# EAGLE design SixPotatoeV4 (EAGLE 9.6.0)
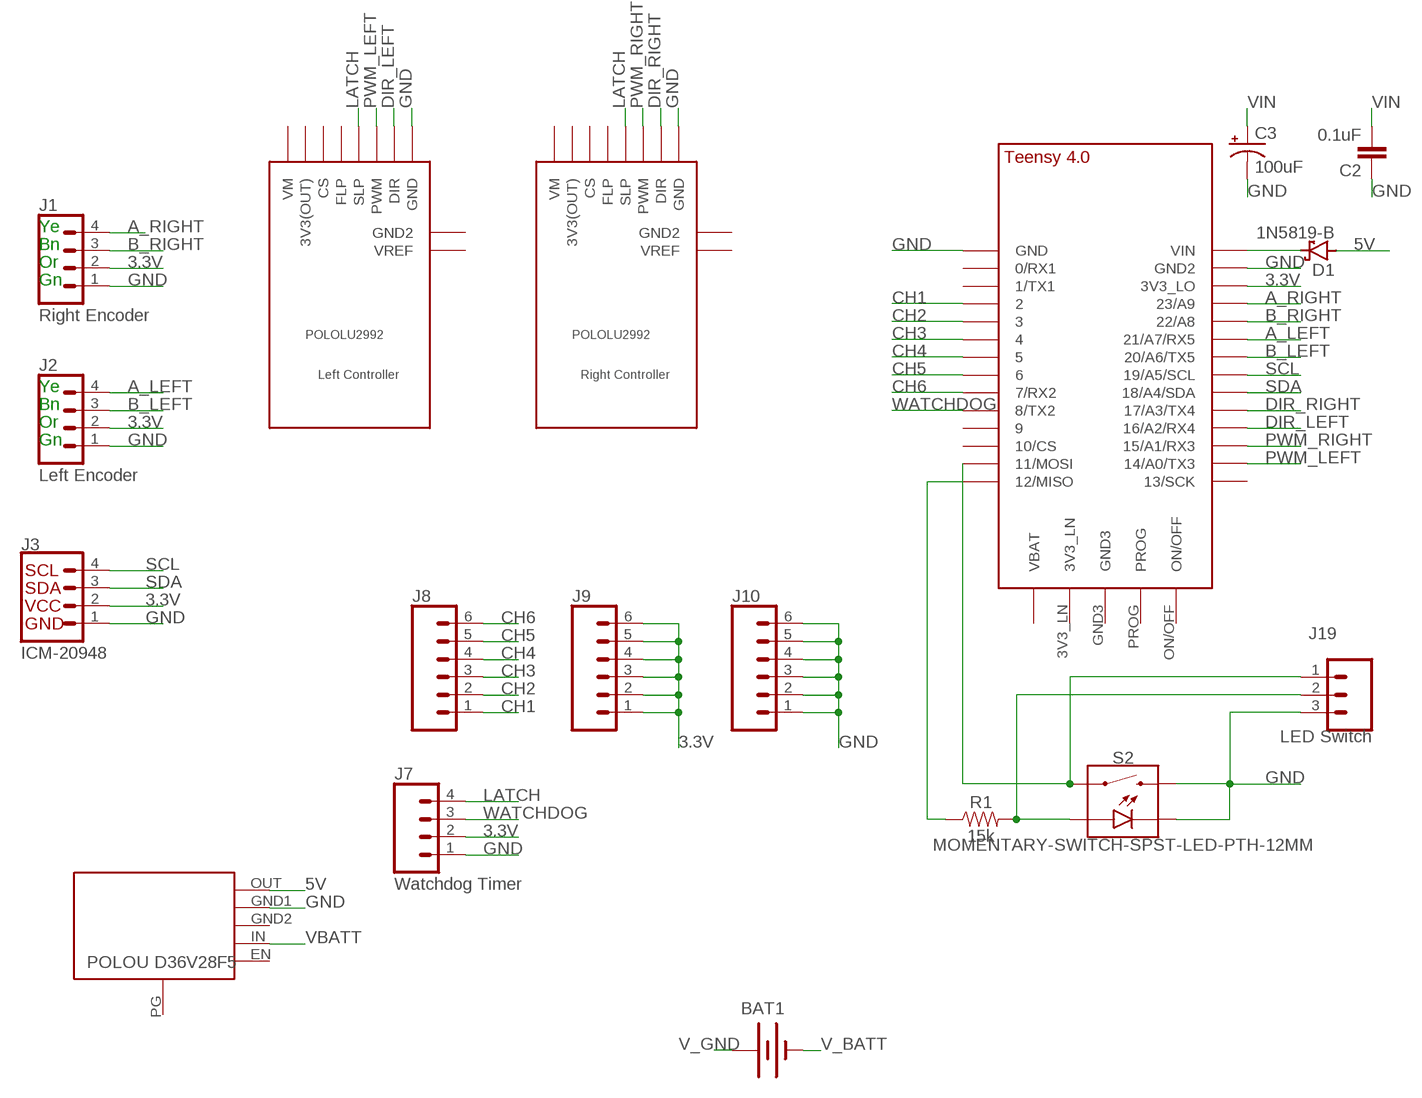
[diagram p0: schematic, sheet 1]

## Parts
BAT1  XT60_MALE  [XT60]
C2  0.1uF  0.1UF-KIT-EZ-50V-20%  [CAP-PTH-SMALL-KIT]
C3  100uF  100UF-POLAR-RADIAL-2.5MM-25V-20%  [CPOL-RADIAL-2.5MM-6.5MM]
D1  1N5819-B  [DO41-7.6]
J1  CONN_04  [1X04]
J2  CONN_04  [1X04]
J3  I2C_STANDARD  [1X04]
J7  CONN_04  [1X04]
J8  CONN_06NO_SILK_FEMALE_PTH  [1X06_NO_SILK]
J9  CONN_06NO_SILK_FEMALE_PTH  [1X06_NO_SILK]
J10  CONN_06NO_SILK_FEMALE_PTH  [1X06_NO_SILK]
J19  CONN_03  [1X03]
R1  15k  15KOHM-HORIZ-1/4W-5%  [AXIAL-0.3]
S2  MOMENTARY-SWITCH-SPST-LED-PTH-12MM  [TACTILE_SWITCH_LED_PTH_12MM]
U$1  TEENSY_4.0  [TEENSY_4.0]
U$2  Left Controller  POLOLU2992_2  [POLOLU2992_2]
U$3  Right Controller  POLOLU2992_2  [POLOLU2992_2]
U$4  POLOU3782  [POLOU3782]

## Nets
3.3V: J1.2 J2.2 J3.2 J7.2 J9.1 J9.2 J9.3 J9.4 J9.5 J9.6 U$1.3V3_LO
5V: D1.A U$4.OUT
A_LEFT: J2.4 U$1.21/A7(21/A7/RX5)
A_RIGHT: J1.4 U$1.23/A9
B_LEFT: J2.3 U$1.20/A6(20/A6/TX5)
B_RIGHT: J1.3 U$1.22/A8
CH1: J8.1 U$1.2
CH2: J8.2 U$1.3/CANTX
CH3: J8.3 U$1.4/CANRX
CH4: J8.4 U$1.5
CH5: J8.5 U$1.6
CH6: J8.6 U$1.7(7/RX2)
DIR_LEFT: U$1.16/A2(16/A2/RX4) U$2.DIR
DIR_RIGHT: U$1.17/A3(17/A3/TX4) U$3.DIR
GND: C2.1 C3.2(-) J1.1 J2.1 J3.1 J7.1 J10.1 J10.2 J10.3 J10.4 J10.5 J10.6 J19.3 S2.2 S2.C U$1.GND U$1.GND2 U$2.GND U$3.GND U$4.GND1
LATCH: J7.4 U$2.SLP U$3.SLP
N$1: D1.C U$1.VIN
N$2: J19.2 R1.P$2 S2.A
N$3: R1.P$1 U$1.12/MISO
N$4: J19.1 S2.4 U$1.11/MOSI
PWM_LEFT: U$1.14/A0(14/A0/TX3) U$2.PWM
PWM_RIGHT: U$1.15/A1(15/A1/RX3) U$3.PWM
SCL: J3.4 U$1.19/A5/SCL
SDA: J3.3 U$1.18/A4/SDA
V_BATT: BAT1.-
V_GND: BAT1.+
VBATT: U$4.IN
VIN: C2.2 C3.1(+)
WATCHDOG: J7.3 U$1.8(8/TX2)
Unconnected: U$1.0/RX(0/RX1) U$1.1/TX(1/TX1) U$1.3V3_LN U$1.9/CS U$1.10/CS U$1.13/SCK U$1.GND3 U$1.ON/OFF U$1.PROG U$1.VBAT\(VBAT) U$2.3V3(OUT) U$2.CS U$2.FLP U$2.GND2 U$2.VM U$2.VREF U$3.3V3(OUT) U$3.CS U$3.FLP U$3.GND2 U$3.VM U$3.VREF U$4.EN U$4.GND2 U$4.PG

## Notes on the sheet
- Ye
- Bn
- Or
- Gn
- Ye
- Bn
- Or
- Gn

## Library data of the parts
BAT1 = Tristan+Robitaille's+Library:XT60_MALE: Vertical Mount Through-Hole Male (for female battery) XT60 Connector
C2 = SparkFun-Capacitors:0.1UF: 0.1µF ceramic capacitors A capacitor is a passive two-terminal electrical component used to store electrical energy temporarily in an electric field.; PROD_ID: CAP-08370
C3 = SparkFun-Capacitors:100UF-POLAR: 100µF polarized capacitors A capacitor is a passive two-terminal electrical component used to store electrical energy temporarily in an electric field.; PROD_ID: CAP-08439
D1 = diode:1N581*: 1.0A SCHOTTKY BARRIER RECTIFIER Source: http://www.diodes.com/datasheets/ds23001.pdf
J1 = SparkFun-Connectors:CONN_04: Multi connection point. Often used as Generic Header-pin footprint for 0.1 inch spaced/style header connections On any of the 0.1 inch spaced packages, you can populate with these: Break Away Headers - Straight <https://www.sparkfun.com/products/116> (PRT-00116) Break Away Male Headers - Right Angle <https://www.sparkfun.com/products/553> (PRT-00553) Female Headers <https://www.sparkfun.com/products/115> (PRT-00115) Break Away Headers - Machine Pin <https://www.sparkfun.com/products/117> (PRT-00117) Break Away Female Headers - Swiss Machine Pin <https://www.sparkfun.com/products/743> (PRT-00743) For SCREWTERMINALS and SPRING TERMINALS visit here: Screw Terimnals on SparkFun.com <https://www.sparkfun.com/search/results?term=Screw+Terminals> (5mm/3.5mm/2.54mm spacing) This device is also useful as a general connection point to wire up your design to another part of your project. Our various solder wires solder well into these plated through hole pads. Hook-Up Wire - Assortment (Stranded, 22 AWG) <https://www.sparkfun.com/products/11375> (PRT-11375) Hook-Up Wire - Assortment (Solid Core, 22 AWG) <https://www.sparkfun.com/products/11367> (PRT-11367) View the entire wire category on our website here <https://www.sparkfun.com/categories/141> Special notes: Molex polarized connector foot print use with SKU : PRT-08231 with associated crimp pins and housings. 1MM SMD Version SKU: PRT-10208; ID: Right Encoder; PROD_ID: CONN-09696
J2 = SparkFun-Connectors:CONN_04: Multi connection point. Often used as Generic Header-pin footprint for 0.1 inch spaced/style header connections On any of the 0.1 inch spaced packages, you can populate with these: Break Away Headers - Straight <https://www.sparkfun.com/products/116> (PRT-00116) Break Away Male Headers - Right Angle <https://www.sparkfun.com/products/553> (PRT-00553) Female Headers <https://www.sparkfun.com/products/115> (PRT-00115) Break Away Headers - Machine Pin <https://www.sparkfun.com/products/117> (PRT-00117) Break Away Female Headers - Swiss Machine Pin <https://www.sparkfun.com/products/743> (PRT-00743) For SCREWTERMINALS and SPRING TERMINALS visit here: Screw Terimnals on SparkFun.com <https://www.sparkfun.com/search/results?term=Screw+Terminals> (5mm/3.5mm/2.54mm spacing) This device is also useful as a general connection point to wire up your design to another part of your project. Our various solder wires solder well into these plated through hole pads. Hook-Up Wire - Assortment (Stranded, 22 AWG) <https://www.sparkfun.com/products/11375> (PRT-11375) Hook-Up Wire - Assortment (Solid Core, 22 AWG) <https://www.sparkfun.com/products/11367> (PRT-11367) View the entire wire category on our website here <https://www.sparkfun.com/categories/141> Special notes: Molex polarized connector foot print use with SKU : PRT-08231 with associated crimp pins and housings. 1MM SMD Version SKU: PRT-10208; ID: Left Encoder; PROD_ID: CONN-09696
J3 = SparkFun-Connectors:I2C_STANDARD: SparkFun I2C Standard Pinout Header SparkFun has standardized on a pinout for all I2C based sensor breakouts. This pinout allows I2C boards to be plugged directly into the headers on Arduino Uno compatible boards, and to be daisy chained easily. Example SparkFun Products: SparkFun Atmospheric Sensor Breakout - BME280 <https://www.sparkfun.com/products/13676> SparkFun Altitude/Pressure Sensor Breakout - MPL3115A2 <https://www.sparkfun.com/products/11084> SparkFun TOF Range Finder Sensor - VL6180 <https://www.sparkfun.com/products/12785>; ID: ICM-20948
J7 = SparkFun-Connectors:CONN_04: Multi connection point. Often used as Generic Header-pin footprint for 0.1 inch spaced/style header connections On any of the 0.1 inch spaced packages, you can populate with these: Break Away Headers - Straight <https://www.sparkfun.com/products/116> (PRT-00116) Break Away Male Headers - Right Angle <https://www.sparkfun.com/products/553> (PRT-00553) Female Headers <https://www.sparkfun.com/products/115> (PRT-00115) Break Away Headers - Machine Pin <https://www.sparkfun.com/products/117> (PRT-00117) Break Away Female Headers - Swiss Machine Pin <https://www.sparkfun.com/products/743> (PRT-00743) For SCREWTERMINALS and SPRING TERMINALS visit here: Screw Terimnals on SparkFun.com <https://www.sparkfun.com/search/results?term=Screw+Terminals> (5mm/3.5mm/2.54mm spacing) This device is also useful as a general connection point to wire up your design to another part of your project. Our various solder wires solder well into these plated through hole pads. Hook-Up Wire - Assortment (Stranded, 22 AWG) <https://www.sparkfun.com/products/11375> (PRT-11375) Hook-Up Wire - Assortment (Solid Core, 22 AWG) <https://www.sparkfun.com/products/11367> (PRT-11367) View the entire wire category on our website here <https://www.sparkfun.com/categories/141> Special notes: Molex polarized connector foot print use with SKU : PRT-08231 with associated crimp pins and housings. 1MM SMD Version SKU: PRT-10208; ID: Watchdog Timer; PROD_ID: CONN-09696
J8-J10 = SparkFun-Connectors:CONN_06: Multi connection point. Often used as Generic Header-pin footprint for 0.1 inch spaced/style header connections On any of the 0.1 inch spaced packages, you can populate with these: Break Away Headers - Straight <https://www.sparkfun.com/products/116> (PRT-00116) Break Away Male Headers - Right Angle <https://www.sparkfun.com/products/553> (PRT-00553) Female Headers <https://www.sparkfun.com/products/115> (PRT-00115) Break Away Headers - Machine Pin <https://www.sparkfun.com/products/117> (PRT-00117) Break Away Female Headers - Swiss Machine Pin <https://www.sparkfun.com/products/743> (PRT-00743) Arduino Stackable Header - 6 Pin <https://www.sparkfun.com/products/9280> (PRT-09280) For SCREWTERMINALS and SPRING TERMINALS visit here: Screw Terimnals on SparkFun.com <https://www.sparkfun.com/search/results?term=Screw+Terminals> (5mm/3.5mm/2.54mm spacing) This device is also useful as a general connection point to wire up your design to another part of your project. Our various solder wires solder well into these plated through hole pads. Hook-Up Wire - Assortment (Stranded, 22 AWG) <https://www.sparkfun.com/products/11375> (PRT-11375) Hook-Up Wire - Assortment (Solid Core, 22 AWG) <https://www.sparkfun.com/products/11367> (PRT-11367) View the entire wire category on our website here <https://www.sparkfun.com/categories/141>; PROD_ID: CONN-08437
J19 = SparkFun-Connectors:CONN_03: Multi connection point. Often used as Generic Header-pin footprint for 0.1 inch spaced/style header connections On any of the 0.1 inch spaced packages, you can populate with these: Break Away Headers - Straight <https://www.sparkfun.com/products/116> (PRT-00116) Break Away Male Headers - Right Angle <https://www.sparkfun.com/products/553> (PRT-00553) Female Headers <https://www.sparkfun.com/products/115> (PRT-00115) Break Away Headers - Machine Pin <https://www.sparkfun.com/products/117> (PRT-00117) Break Away Female Headers - Swiss Machine Pin <https://www.sparkfun.com/products/743> (PRT-00743) Stackable Header - 3 Pin (Female, 0.1") <https://www.sparkfun.com/products/13875> (PRT-13875) For SCREWTERMINALS and SPRING TERMINALS visit here: Screw Terimnals on SparkFun.com <https://www.sparkfun.com/search/results?term=Screw+Terminals> (5mm/3.5mm/2.54mm spacing) This device is also useful as a general connection point to wire up your design to another part of your project. Our various solder wires solder well into these plated through hole pads. Hook-Up Wire - Assortment (Stranded, 22 AWG) <https://www.sparkfun.com/products/11375> (PRT-11375) Hook-Up Wire - Assortment (Solid Core, 22 AWG) <https://www.sparkfun.com/products/11367> (PRT-11367) View the entire wire category on our website here <https://www.sparkfun.com/categories/141> Special notes: Molex polarized connector foot print use with SKU : PRT-08232 with associated crimp pins and housings.; ID: LED Switch
R1 = SparkFun-Resistors:15KOHM: 15kΩ resistor A resistor is a passive two-terminal electrical component that implements electrical resistance as a circuit element. Resistors act to reduce current flow, and, at the same time, act to lower voltage levels within circuits. - Wikipedia; PROD_ID: RES-11360
S2 = TimEagleLibrary:MOMENTARY-SWITCH-SPST-LED: Momentary Switch (Pushbutton) - SPST - w/ LED Normally-open (NO) SPST momentary switches (buttons, pushbuttons), with a built-in LED. Variants PTH-CHERRY - Cherry MX Switch Cherry MX Keyswitches are top-of-the-line mechanical keyboard switches. They’re satisfyingly “clicky”, reliable up to tens-of-millions of key presses, and a standard in gaming and programming keyboards across the globe. This ‘blue’ version Cherry MX Switch is favored by most due to its secondary internal actuator making it less likely to “double-tap.” If you are looking for a noticeably audible and high-quality key switch, this is the perfect option for you! Cherry MX Switch <https://www.sparkfun.com/products/13834> (COM-13834) Cherry MX Switch Breakout <https://www.sparkfun.com/products/13773> (BOB-13773) PTH-12MM and PTH-12MM-KIT - 12mm Illuminated LED KIT variant is for soldering kits. There is no tStop (covering up the top side of the pads with mask). This helps the beginner see which side they should be soldering too. LED Tactile Button Breakout <https://www.sparkfun.com/products/10467> (BOB-10467) LED Tactile Button - Red <https://www.sparkfun.com/products/10442> (COM-10442) LED Tactile Button - Blue <https://www.sparkfun.com/products/10443> (COM-10443) LED Tactile Button - Green <https://www.sparkfun.com/products/10440> (COM-10440) LED Tactile Button - Orange <https://www.sparkfun.com/products/10441> (COM-10441) LED Tactile Button - White <https://www.sparkfun.com/products/10439> (COM-10439); PROD_ID: SWCH-11758; SF_SKU: COM-10442
U$1 = TEENSY 4.0:TEENSY_4.0
U$2 U$3 = TimEagleLibrary:POLOLU2992_2
U$4 = TimEagleLibrary:POLOU3782

## Board
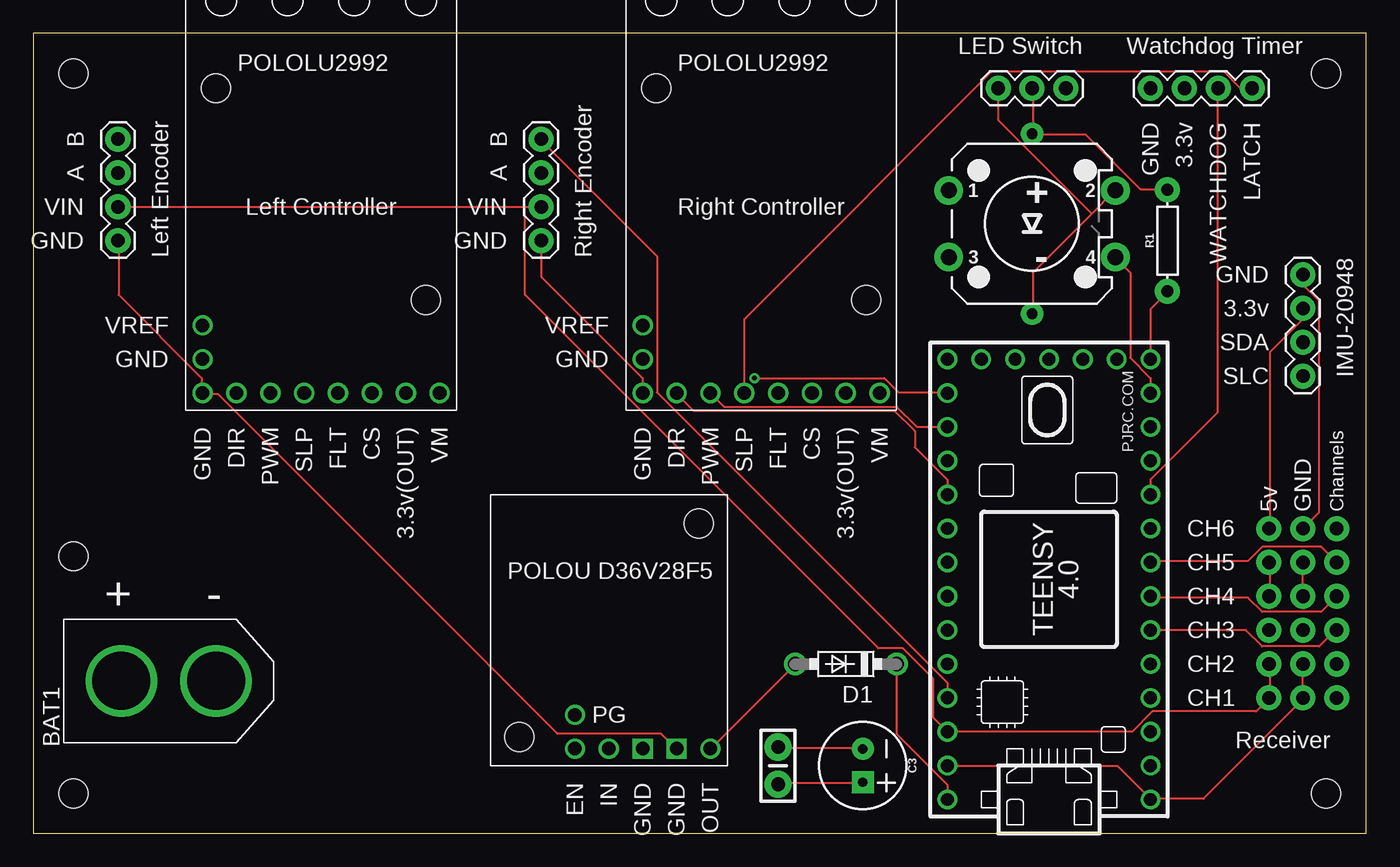
[diagram p1: board, top side]
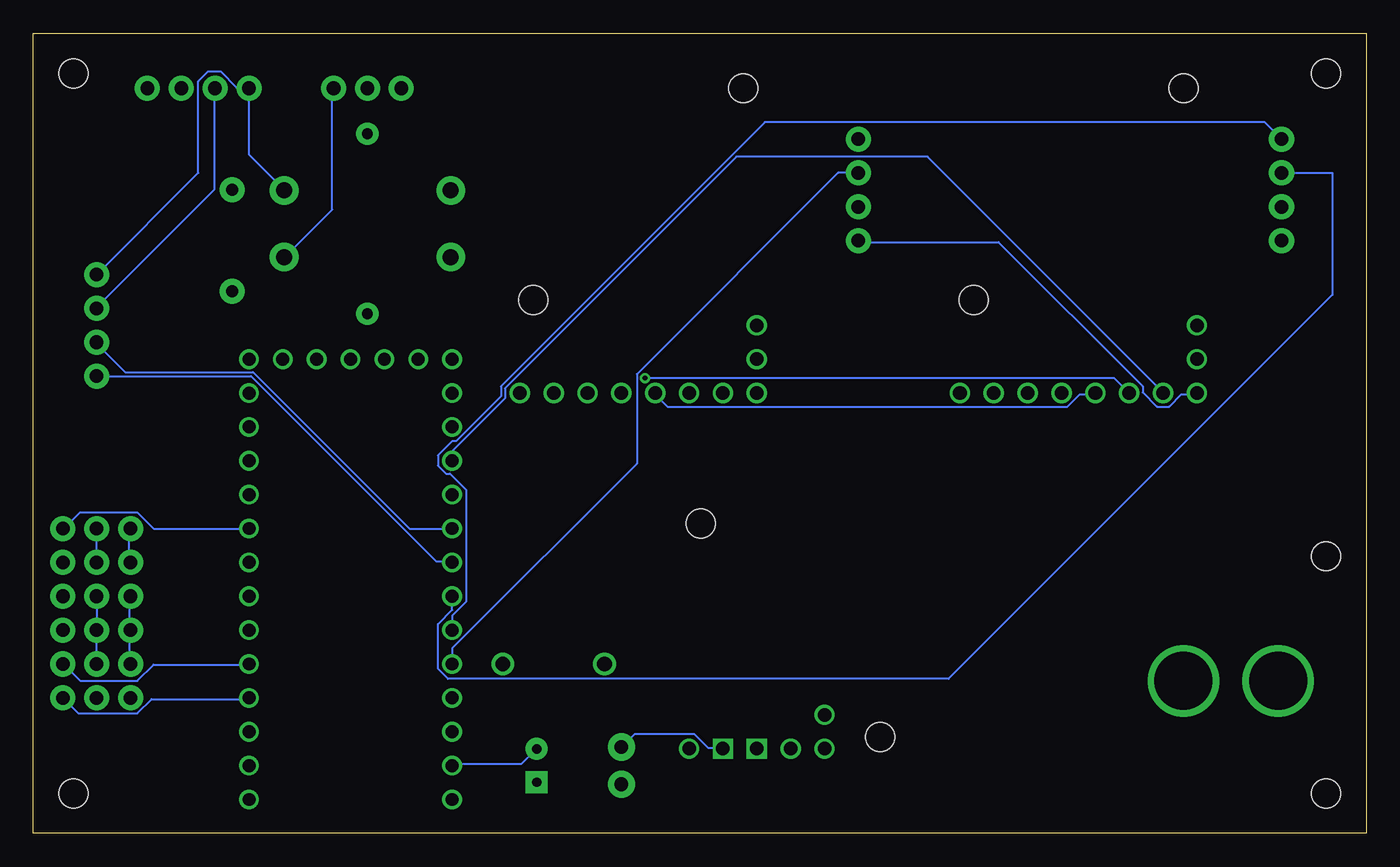
[diagram p2: board, bottom side, seen from below]

Size 100 x 60 mm. Coordinates in mm from the lower left corner, seen from the top.
Outline: 0,0 100,0 100,60 0,60 0,0
Copper layers (1*16): Top 0.035mm / dielectric 1.5mm / Bottom 0.035mm
Design rules "default": minimum track width 6mil, minimum drill 0.35mm, track to track 6mil, track to pad 6mil, pad to pad 6mil, via to via 6mil, smd to smd 6mil, copper to edge 40mil, drill to drill 6mil, minimum pad ring 10mil, minimum via ring 8mil, stop-mask expansion 4mil, vias tented up to drill 0mil, thermal gap 10mil
Holes 2.18 mm at 97,57 97,3 3,3 3,57 3,20.78

### Footprints (pad centres in the part's own frame; a part is rotated, then mirrored left to right if it is on the bottom)
XT60 = drill 4.35: + 3.55,0; - -3.55,0
CAP-PTH-SMALL-KIT = drill 1.016 pad 2.032: 1 -1.397,0; 2 1.397,0
CPOL-RADIAL-2.5MM-6.5MM = drill 0.7 pad 1.651 square: 1 1.25,0 | drill 0.7 pad 1.651: 2 -1.25,0
DO41-7.6 = drill 1.1 pad 1.7: A 3.81,0; C -3.81,0
1X04 = drill 1.016 pad 1.88: 1 0,0; 2 2.54,0; 3 5.08,0; 4 7.62,0
1X06_NO_SILK = drill 1.016 pad 1.88: 1 0,0; 2 2.54,0; 3 5.08,0; 4 7.62,0; 5 10.16,0; 6 12.7,0
1X03 = drill 1.016 pad 1.88: 1 0,0; 2 2.54,0; 3 5.08,0
AXIAL-0.3 = drill 0.9 pad 1.88: P$1 -3.81,0; P$2 3.81,0
TACTILE_SWITCH_LED_PTH_12MM = drill 1.2 pad 2.159: 1 -6.25,2.5; 2 6.25,2.5; 3 -6.25,-2.5; 4 6.25,-2.5 | drill 0.8 pad 1.676: A 0,6.75; C 0,-6.75
TEENSY_4.0 = drill 0.965: 0/RX -13.97,-7.62; 1/TX -11.43,-7.62; 2 -8.89,-7.62; 3/CANTX -6.35,-7.62; 3V3_LN 16.51,-2.54; 3V3_LO -11.43,7.62; 4/CANRX -3.81,-7.62; 5 -1.27,-7.62; 6 1.27,-7.62; 7 3.81,-7.62; 8 6.35,-7.62; 9/CS 8.89,-7.62; 10/CS 11.43,-7.62; 11/MOSI 13.97,-7.62; 12/MISO 16.51,-7.62; 13/SCK 16.51,7.62; 14/A0 13.97,7.62; 15/A1 11.43,7.62; 16/A2 8.89,7.62; 17/A3 6.35,7.62; 18/A4/SDA 3.81,7.62; 19/A5/SCL 1.27,7.62; 20/A6 -1.27,7.62; 21/A7 -3.81,7.62; 22/A8 -6.35,7.62; 23/A9 -8.89,7.62; GND -16.51,-7.62; GND2 -13.97,7.62; GND3 16.51,0; ON/OFF 16.51,5.08; PROG 16.51,2.54; VBAT\ 16.51,-5.08; VIN -16.51,7.62
POLOLU2992_2 = drill 1.016: 3V3(OUT) 3.81,31.75; CS 6.35,31.75; DIR 16.51,31.75; FLP 8.89,31.75; GND 19.05,31.75; GND2 19.05,29.21; PWM 13.97,31.75; SLP 11.43,31.75; VM 1.27,31.75; VREF 19.05,26.67 | hole 2.184: 2.286,24.765; 18.034,8.89
POLOU3782 = drill 1.016: EN -2.54,-7.62; IN 0,-7.62; OUT 7.62,-7.62; PG -2.54,-5.08 | drill 1.016 square: GND1 5.08,-7.62; GND2 2.54,-7.62 | hole 2.184: -6.731,-6.731; 6.731,9.271

### Placement (x,y rotation side)
BAT1  10.16,11.43 180 top
C2  55.88,5.08 270 top
C3  62.23,5.08 270 top
D1  60.96,12.7 180 top
J1  38.1,44.45 90 top
J2  6.35,44.45 90 top
J3  95.25,41.91 270 top
J7  83.82,55.88 0 top
J8  97.79,10.16 90 top
J9  92.71,10.16 90 top
J10  95.25,10.16 90 top
J19  77.47,55.88 180 top
R1  85.09,44.45 90 top
S2  74.93,45.72 0 top
U$1  76.2,19.05 90 top
U$2  31.75,64.77 180 top
U$3  64.77,64.77 180 top
U$4  43.18,13.97 0 top

### Tracks (layer width: path | path; a pad name or v marks a point on that pad's centre or on a via)
3.3V
  Top 0.152: 36.88,46.94 38.1,46.94 J1.2 | 36.88,46.94 6.4,46.94 J2.2 | J9.2 92.81,12.65 92.81,10.21 J9.1 92.66,10.06 91.75,9.14 83.97,9.14 82.45,7.62 U$1.3V3_LO 67.51,8.69 67.51,11.58 65.23,13.87 63.4,13.87 36.88,40.39 36.88,46.94 | J9.5 92.81,20.27 92.81,17.83 J9.4 | J3.2 95.25,38.56 92.81,36.12 92.81,22.86 J9.6
  Bottom 0.152: 92.81,15.24 92.81,17.68 J9.4 | J9.6 92.81,22.86 92.81,20.42 J9.5 | J7.2 86.41,55.78 86.41,48.31 95.25,39.47 J3.2 | 92.81,15.24 92.81,12.8 J9.2 | 92.81,15.24 J9.3
5V
  Top 0.152: U$4.OUT 50.9,6.4 57.15,12.65 D1.A
A_LEFT
  Bottom 0.152: U$1.21/A7 68.58,16.31 67.51,17.37 67.51,25.76 68.73,26.98 69.04,26.98 69.65,27.58 69.65,28.35 68.58,29.41 68.28,29.41 64.92,32.77 64.92,33.53 45.11,53.34 7.62,53.34 J2.4
A_RIGHT
  Top 0.152: U$1.23/A9 68.58,11.28 46.79,33.07 46.79,43.28 38.1,51.97 J1.4
B_LEFT
  Bottom 0.152: U$1.20/A6 68.58,16.76 69.65,15.7 69.65,12.34 68.89,11.58 31.34,11.58 2.54,40.39 2.54,49.53 J2.3 6.4,49.53
B_RIGHT
  Bottom 0.152: U$1.22/A8 68.58,13.87 54.71,27.74 54.71,34.44 39.62,49.53 J1.3
CH1
  Bottom 0.152: J8.1 96.62,8.99 92.2,8.99 91.14,10.06 83.82,10.06 U$1.2
CH2
  Bottom 0.152: U$1.3/CANTX 83.82,12.65 90.98,12.65 92.2,11.43 96.47,11.43 97.69,12.65 J8.2
CH3
  Top 0.152: U$1.4/CANRX 90.98,15.24 92.2,14.02 96.47,14.02 97.69,15.24 J8.3
CH4
  Top 0.152: J8.4 96.62,16.61 92.2,16.61 91.14,17.68 83.82,17.68 U$1.5
CH5
  Top 0.152: J8.5 96.62,21.49 92.2,21.49 91.14,20.42 83.82,20.42 U$1.6
CH6
  Bottom 0.152: U$1.7 90.98,22.86 92.2,24.08 96.47,24.08 97.69,22.86 J8.6
DIR_LEFT
  Bottom 0.152: U$1.16/A2 68.58,28.65 64.62,32.61 64.62,33.38 47.24,50.75 32.92,50.75 15.24,33.07 U$2.DIR
DIR_RIGHT
  Top 0.152: U$1.17/A3 68.58,26.52 66.14,28.96 66.14,30.18 64.62,31.7 49.53,31.7 48.31,32.92 U$3.DIR
GND
  Top 0.152: J2.1 6.4,44.35 6.4,40.39 12.65,34.14 12.65,33.07 U$2.GND 12.8,32.92 13.87,32.92 39.32,7.47 47.09,7.47 48.16,6.4 U$4.GND1 | U$3.GND 45.72,34.14 38.1,41.76 J1.1 | 79.4,46.48 81.08,48.16 S2.2 | 79.4,46.48 74.98,42.06 74.98,39.01 S2.C | J19.3 72.39,53.49 79.4,46.48 | J10.4 J10.5 | J3.1 95.25,41.15 96.47,39.93 96.47,24.08 J10.6 | C3.2 62.18,6.4 55.93,6.4 C2.1 | 83.82,2.59 87.78,2.59 95.25,10.06 J10.1 J10.2 | 83.82,2.59 81.38,5.03 68.58,5.03 U$1.GND2 | 83.82,2.59 U$1.GND
  Bottom 0.152: U$2.GND 12.8,32.92 13.87,32.92 14.78,32 15.7,32 16.76,33.07 16.76,33.53 27.58,44.35 38.1,44.35 J1.1 | S2.2 81.23,48.31 83.82,50.9 J7.1 83.82,55.93 84.73,55.93 85.95,57.15 86.87,57.15 87.63,56.39 87.63,49.53 J3.1 | J10.4 J10.3 J10.2 | J10.5 J10.6 | U$1.GND2 68.58,5.18 63.4,5.18 62.33,6.25 C3.2 | U$4.GND1 48.31,6.4 49.38,6.4 50.44,7.47 54.86,7.47 55.78,6.55 C2.1
LATCH
  Top 0.152: U$3.SLP 53.34,38.56 71.93,57.15 89.31,57.15 90.53,55.93 91.44,55.93 J7.4
  Bottom 0.152: U$2.SLP 20.42,32.92 21.49,32.92 22.4,32 52.43,32 53.34,32.92 U$3.SLP
N$1
  Top 0.152: U$1.VIN 68.58,3.66 64.77,7.47 D1.C
N$2
  Top 0.152: J19.2 74.98,55.78 74.98,52.58 S2.A 74.98,52.43 78.94,52.43 83.06,48.31 85.04,48.31 R1.P$2
N$3
  Top 0.152: U$1.12/MISO 83.82,39.32 85.04,40.54 R1.P$1
N$4
  Top 0.152: U$1.11/MOSI 83.82,34.14 82.3,35.66 82.3,42.06 81.23,43.13 S2.4
  Bottom 0.152: J19.1 77.57,55.78 77.57,46.79 81.08,43.28 S2.4
PWM_LEFT  (via drill 0.35)
  Top 0.152: v54.1,34.14 63.86,34.14 64.92,33.07 68.58,33.07 U$1.14/A0
  Bottom 0.152: v54.1,34.14 18.9,34.14 U$2.PWM
PWM_RIGHT
  Top 0.152: U$1.15/A1 66.29,30.48 64.77,32 51.82,32 U$3.PWM
SCL
  Bottom 0.152: J3.4 83.67,34.29 69.8,20.42 68.58,20.42 U$1.19/A5/SCL
SDA
  Bottom 0.152: U$1.18/A4/SDA 71.78,22.86 83.52,34.59 93.12,34.59 95.25,36.73 J3.3
VIN
  Top 0.152: C3.1 62.18,3.81 55.93,3.81 C2.2
WATCHDOG
  Top 0.152: U$1.8 83.82,26.52 88.85,31.55 88.85,55.78 J7.3

### Text on the board
tPlace: LED Switch | Watchdog Timer | GND | 3.3v | WATCHDOG | LATCH | B | B | A | A | VIN | VIN | GND | GND | Left Encoder | Right Encoder | IMU-20948 | GND | 3.3v | SDA | SLC | 5v | GND | Channels | CH6 | CH5 | CH4 | CH3 | CH2 | CH1 | PG | Receiver | EN | IN | GND | GND | OUT